# EAGLE design source_eagle (EAGLE 9.6.2)
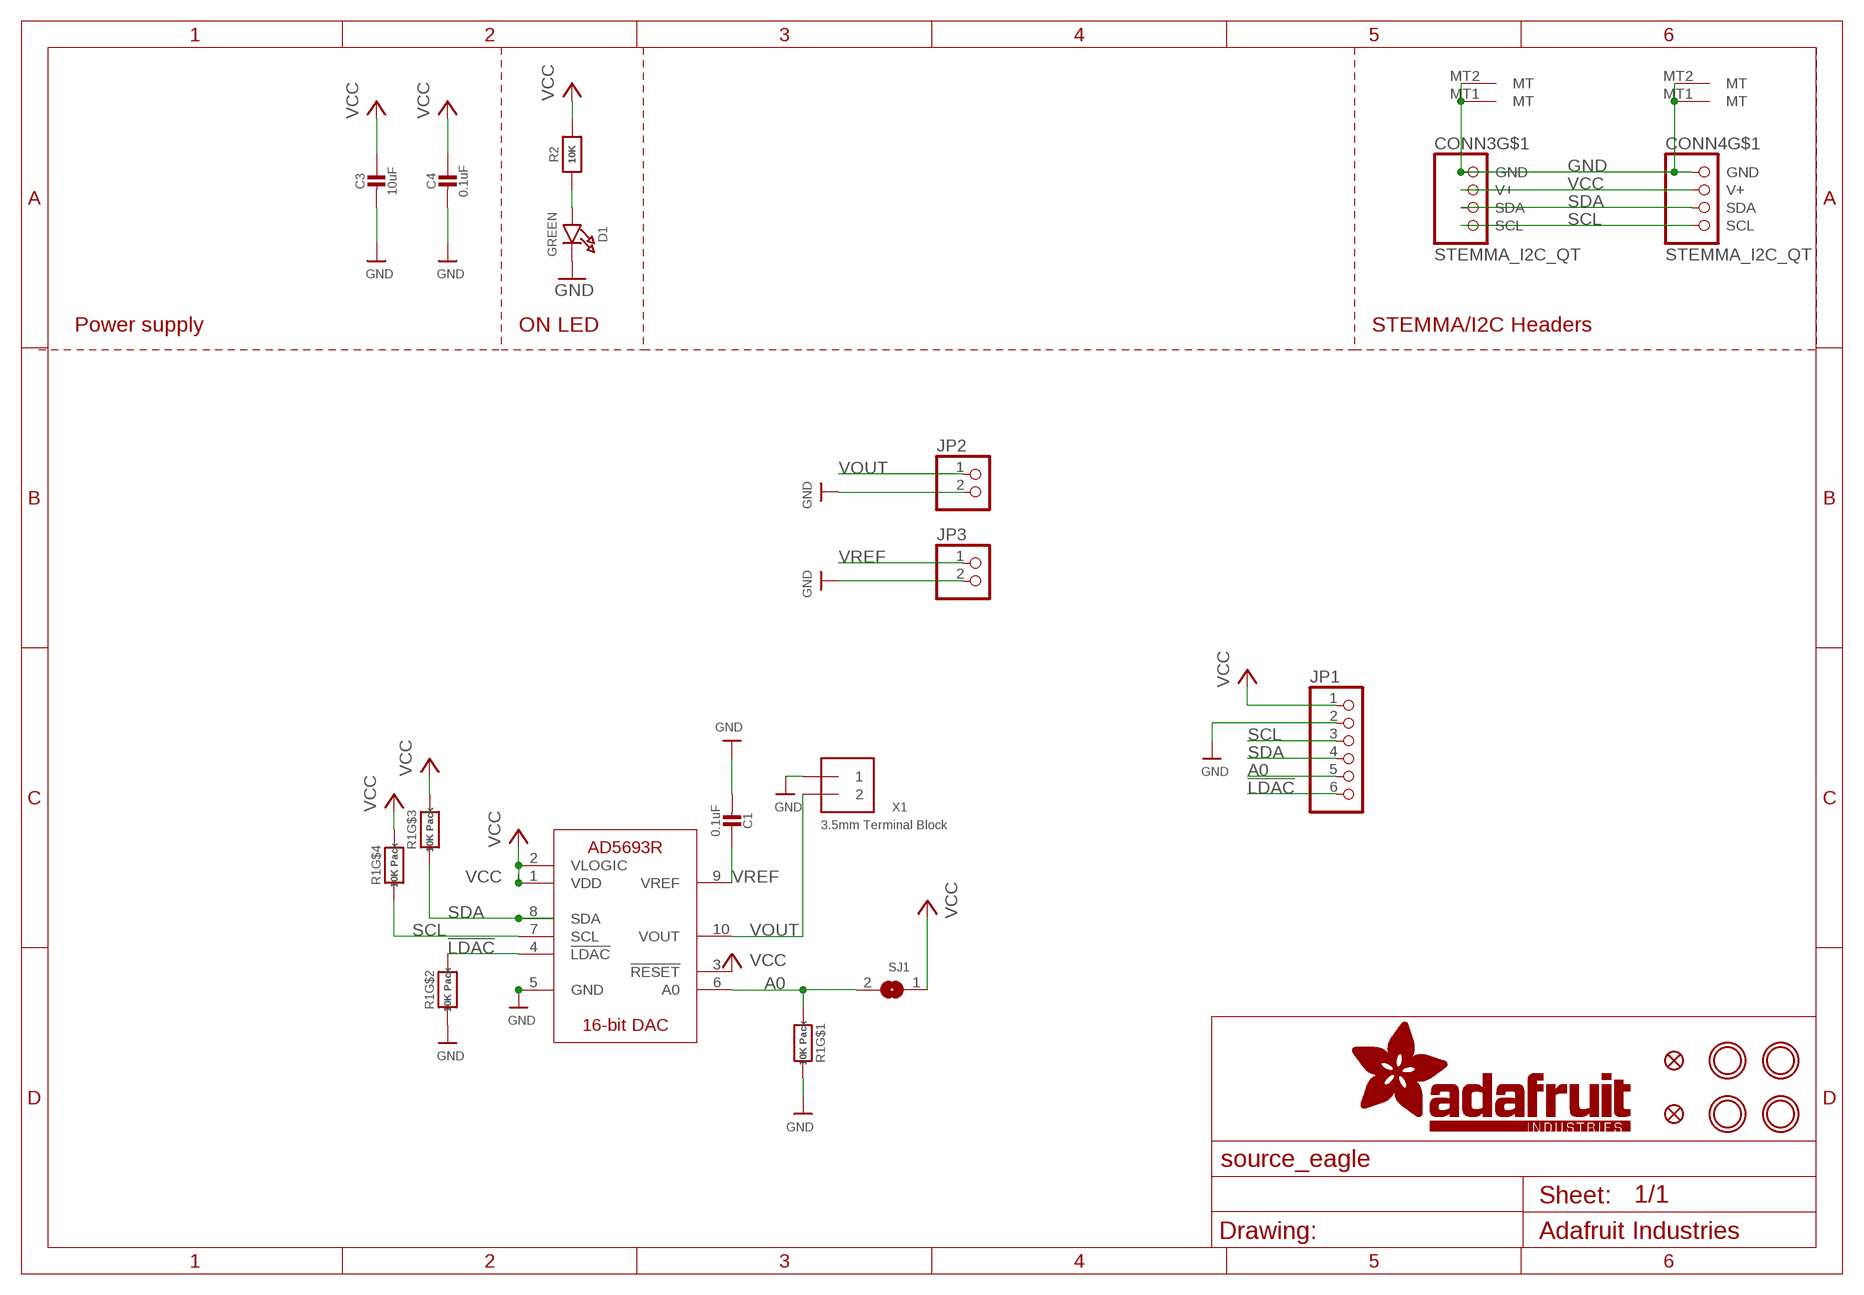
[diagram p0: schematic, sheet 1]

## Parts
C1  0.1uF  CAP_CERAMIC0603_NO  [0603-NO]
C3  10uF  CAP_CERAMIC0805-NOOUTLINE  [0805-NO]
C4  0.1uF  CAP_CERAMIC0603_NO  [0603-NO]
CONN3  STEMMA_I2C_QT  [JST_SH4]
CONN4  STEMMA_I2C_QT  [JST_SH4]
D1  GREEN  LED0603_NOOUTLINE  [CHIPLED_0603_NOOUTLINE]
FID3  FIDUCIAL_1MM  [FIDUCIAL_1MM]
FID4  FIDUCIAL_1MM  [FIDUCIAL_1MM]
IC2  AD5693R_10PIN_RMZ  [MSOP10]
JP1  HEADER-1X670MIL  [1X06_ROUND_70]
JP2  HEADER-1X2ROUND  [1X02_ROUND]
JP3  HEADER-1X2ROUND  [1X02_ROUND]
R1  10K Pack  RESISTOR_4PACK  [RESPACK_4X0603]
R2  10K  RESISTOR_0603_NOOUT  [0603-NO]
SJ1  SOLDERJUMPER  [SOLDERJUMPER_ARROW_NOPASTE]
U$20  MOUNTINGHOLE2.5  [MOUNTINGHOLE_2.5_PLATED]
U$21  MOUNTINGHOLE2.5  [MOUNTINGHOLE_2.5_PLATED]
U$25  MOUNTINGHOLE2.5  [MOUNTINGHOLE_2.5_PLATED]
U$27  MOUNTINGHOLE2.5  [MOUNTINGHOLE_2.5_PLATED]
X1  3.5mm Terminal Block  TERMBLOCK_1X2_3.5MM  [TERMBLOCK_1X2-3.5MM]

## Nets
!LDAC: IC2.4(!LDAC) JP1.6 R1.7
A0: IC2.6(A0) JP1.5 R1.8 SJ1.2
GND: C1.2 C3.2 C4.2 CONN3.1(GND) CONN3.MT1(MT) CONN3.MT2(MT) CONN4.1(GND) CONN4.MT1(MT) CONN4.MT2(MT) D1.C IC2.5(GND) JP1.2 JP2.2 JP3.2 R1.1 R1.2 X1.1
N$1: D1.A R2.1
SCL: CONN3.4(SCL) CONN4.4(SCL) IC2.7(SCL) JP1.3 R1.4
SDA: CONN3.3(SDA) CONN4.3(SDA) IC2.8(SDA) JP1.4 R1.3
VCC [highpower]: C3.1 C4.1 CONN3.2(V+) CONN4.2(V+) IC2.1(VDD) IC2.2(VLOGIC) IC2.3(!RESET) JP1.1 R1.5 R1.6 R2.2 SJ1.1
VOUT: IC2.10(VOUT) JP2.1 X1.2
VREF: C1.1 IC2.9(VREF) JP3.1

## Notes on the sheet
- Power supply | ON LED | STEMMA/I2C Headers

## Library data of the parts
C1 C3 C4 = microbuilder:CAP_CERAMIC: Ceramic Capacitors For new designs, use the packages preceded by an '_' character since they are more reliable: The following footprints should be used on most boards: _0402 - Standard footprint for regular board layouts _0603 - Standard footprint for regular board layouts _0805 - Standard footprint for regular board layouts _1206 - Standard footprint for regular board layouts For extremely tight-pitch boards where space is at a premium, the following 'micro-pitch' footprints can be used (smaller pads, no silkscreen outline, etc.): _0402MP - Micro-pitch footprint for very dense/compact boards _0603MP - Micro-pitch footprint for very dense/compact boards _0805MP - Micro-pitch footprint for very dense/compact boards _1206MP - Micro-pitch footprint for very dense/compact boards
CONN3 CONN4 = adafruit_electromech:STEMMA_I2C; LCSC: C2845363
D1 = microbuilder:LED: LED 0603 - 0603 Surface Mount Package 2mA: Green LED - Low Power (3.9mcd, 2ma, 1.7Vf) - Digikey: 475-2709-2-ND Orange LED - Low Power (9.8mcd, 2ma, 1.8Vf) - Digikey: 475-1194-2-ND Red LED - Low Power (5mcd, 2ma, 1.8Vf) - Digikey: 475-1195-2-ND Yellow LED - Low Power (7mcd, 2ma, 1.8Vf) - Digikey: 475-1196-2-ND 5mA: Blue LED - Low Power (17mcd, 5ma, 2.9Vf) - Digikey: LNJ937W8CRACT-ND 0805 - 0805 Surface Mount Package 2mA: Red LED (8.8mcd, 2mA, 1.8Vf, Clear) - Low Power [Digikey: 475-2510-1-ND] Green LED (5mcd, 2mA, 1.8Vf, Clear) - Low Power [Digikey: 475-2730-1-ND] Yellow LED (11.3mcd, 2mA, 1.8Vf, Clear) - Low Power [Digikey: 475-2555-1-ND] 20mA: Red LED (104mcd, 20mA, Diffused) - LS R976 [Digikey: 475-1278-6-ND] Red LED (12mcd, 20mA, 2.0Vf, Clear) - APT2012EC [Digikey: 754-1128-1-ND] Green LED (15mcd, 20mA, 2.2Vf, Clear) - APT2012GC [Digikey: 754-1131-1-ND] Orange LED (160mcd, 20mA, 2.1Vf, Clear) - APT2012SECK [Digikey: 754-1130-1-ND] 1206 - 1206 Surface Mount Package Green LED (26mcd, 20mA, Diffused) - LG N971 [Digikey: 475-1407-6-ND] Red LED (15mcd, 20mA, Diffused) - LH N974 [Digikey: 475-1416-6-ND] Cree - Cree High-Power Surface Mount LEDs XPEBWT-L1-0000-00D50 - White 111lm 350mA 2.9Vf 6200K 110° XTEAWT-00-0000-00000LEE3 - White 114lm 350mA 2.85Vf 5000K 115° Everlight - Everlight 45-21 Series Surface Mount LEDs 45-21/QK2C-B2832AC2CB2/2T - Warm White 2000mcd 20mA 3.25Vf 3050K 120° 45-21/LK2C-B38452C4CB2/2T - Nuetral White 2000mcd 20mA 3.25Vf 4150K 120° 45-21/LK2C-B50634C6CB2/2T - Cold White 2200mcd 20mA 3.25Vf 5650K 120° PLCC2 Reverse Mount LS T77K-J1L2-1-0-2-R18-Z - Red 11.25mcd 2mA 1.8Vf 630nm 120° LO T77K-L1M2-24-Z - Orange 19.6mcd 2mA 1.8Vf 606nm 120° LY T77K-K2M1-26-Z - Yellow 15.7mcd 2mA 1.8Vf 587nm 120°; ROT: 270
FID3 FID4 = microbuilder:FIDUCIAL: Fiducial Alignment Points Various fiducial points for machine vision alignment.; BOM: EXCLUDE
IC2 = adafruit_sensor:AD5693R_10PIN
JP1 = microbuilder:HEADER-1X6: PIN HEADER
JP2 JP3 = microbuilder:HEADER-1X2: PIN HEADER
R1 = microbuilder:RESISTOR_4PACK: Resistor Packs (4 resistors) 4 x 0603 10K 1/16W - Digikey: YC164J-10KCT-ND
R2 = microbuilder:RESISTOR: Resistors For new designs, use the packages preceded by an '_' character since they are more reliable: The following footprints should be used on most boards: _0402 - Standard footprint for regular board layouts _0603 - Standard footprint for regular board layouts _0805 - Standard footprint for regular board layouts _1206 - Standard footprint for regular board layouts For extremely tight-pitch boards where space is at a premium, the following 'micro-pitch' footprints can be used (smaller pads, no silkscreen outline, etc.): _0402MP - Micro-pitch footprint for very dense/compact boards _0603MP - Micro-pitch footprint for very dense/compact boards _0805MP - Micro-pitch footprint for very dense/compact boards _1206MP - Micro-pitch footprint for very dense/compact boards
SJ1 = microbuilder:SOLDERJUMPER: SMD Solder JUMPER Solder the two pads together to create a connection, or remove the solder to break it. REFLOW - Use this footprint for solder paste and reflow ovens. WAVE - Use this footprint for hand-soldering (larger pads). CLOSED - Has a trace between the two pads to ensure it is closed by default. The trace needs to be cut to disable the jumper, and can be closed again by creating a solder bridge between the two pads.; BOM: EXCLUDE
U$20 U$21 U$25 U$27 = adafruit_electromech:MOUNTINGHOLE: Mounting Hole For #2 screws (0.086"/2.18mm width, 0.094"/2.4mm hole) use 2.5mm; BOM: EXCLUDE
X1 = adafruit_electromech:TERMBLOCK_1X2: 3.5mm Terminal block http://www.ladyada.net/library/pcb/eaglelibrary.html; ROT: 180

## Net classes
1 highpower: width 0.305 mm, drill 0.483 mm
2 lowpower: width 0.254 mm, drill 0.483 mm

## Board
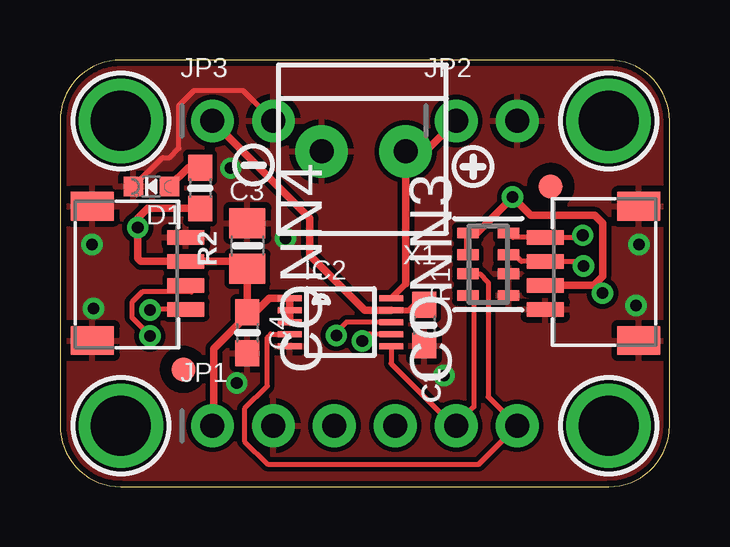
[diagram p1: board, top side]
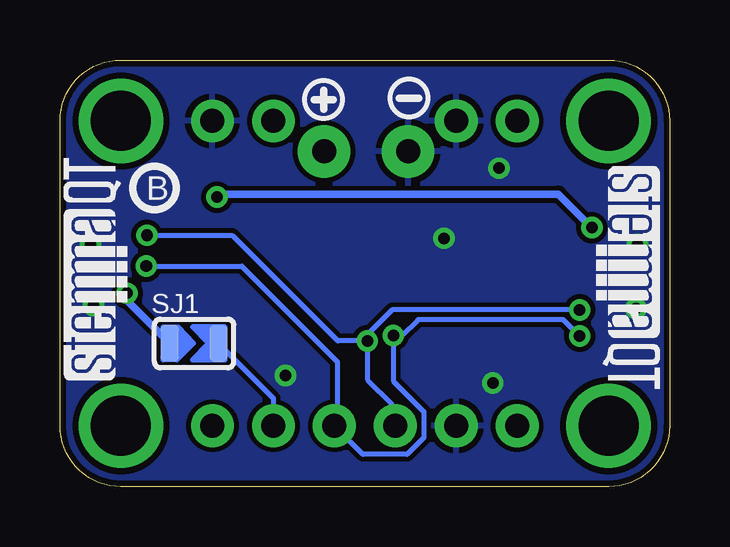
[diagram p2: board, bottom side, seen from below]

Size 25.4 x 17.78 mm. Coordinates in mm from the lower left corner, seen from the top.
Outline: 0,15.24 0,2.54 arc90 2.54,0 22.86,0 arc90 25.4,2.54 25.4,15.24 arc90 22.86,17.78 2.54,17.78 arc90 0,15.24
Copper layers (1*16): Top 0.035mm / dielectric 1.5mm / Bottom 0.035mm
Design rules "adafruit 8-8": minimum track width 6mil, minimum drill 15.5mil, track to track 8mil, track to pad 8mil, pad to pad 8mil, via to via 8mil, smd to smd 8mil, copper to edge 10mil, drill to drill 8mil, minimum pad ring 10mil, minimum via ring 8mil, stop-mask expansion 2mil, vias tented up to drill 20mil, thermal gap 10mil

### Footprints (pad centres in the part's own frame; a part is rotated, then mirrored left to right if it is on the bottom)
0603-NO = smd 1.075 x 1: 1 -0.85,0; 2 0.85,0
0805-NO = smd 1.24 x 1.5: 1 -0.95,0; 2 0.95,0
JST_SH4 = smd 0.6 x 1.55: 1 -1.5,2.006; 2 -0.5,2.006; 3 0.5,2.006; 4 1.5,2.006 | smd 1.2 x 1.8: MT1 -2.8,-1.894; MT2 2.8,-1.894
CHIPLED_0603_NOOUTLINE = smd 0.8 x 0.8: A 0,-0.75; C 0,0.75
FIDUCIAL_1MM = smd 1 x 1: 1 0,0
MSOP10 = smd 0.25 x 1: 1 -1,-2.113; 2 -0.5,-2.113; 3 0,-2.113; 4 0.5,-2.113; 5 1,-2.113; 6 1,2.113; 7 0.5,2.113; 8 0,2.113; 9 -0.5,2.113; 10 -1,2.113
1X06_ROUND_70 = drill 1 pad 1.778: 1 -6.35,0; 2 -3.81,0; 3 -1.27,0; 4 1.27,0; 5 3.81,0; 6 6.35,0
1X02_ROUND = drill 1 pad 1.778: 1 -1.27,0; 2 1.27,0
RESPACK_4X0603 = smd 0.45 x 0.9: 1 -1.3,-0.85; 2 -0.4,-0.85; 3 0.4,-0.85; 4 1.3,-0.85; 5 1.3,0.85; 6 0.4,0.85; 7 -0.4,0.85; 8 -1.3,0.85
SOLDERJUMPER_ARROW_NOPASTE = smd 0.762 x 1.524: 1 -1.016,0; 2 1.016,0
MOUNTINGHOLE_2.5_PLATED = drill 2.5 pad 3.2: P$1 0,0
TERMBLOCK_1X2-3.5MM = drill 1 pad 2.184: 1 1.8,0; 2 -1.7,0

### Placement (x,y rotation side)
C1  15.18,6.73 270 top
C3  7.81,10.03 90 top
C4  7.81,6.41 270 top
CONN3  22.23,8.89 90 top
CONN4  3.24,8.89 270 top
D1  3.81,12.51 90 top
FID3  5.14,4.89 0 top
FID4  20.45,12.51 0 top
IC2  11.68,6.86 270 top
JP1  12.7,2.54 0 top
JP2  17.78,15.24 0 top
JP3  7.62,15.24 0 top
PLABEL0  [PLABEL0]  6.35,0.89 0 top
PLABEL1  [PLABEL1]  8.89,4.19 0 top
PLABEL2  [PLABEL2]  11.43,0.89 0 top
PLABEL3  [PLABEL3]  13.97,4.19 0 top
PLABEL4  [PLABEL4]  19.18,4.19 0 top
PLABEL5  [PLABEL5]  16.64,0.89 0 top
PLABEL6  [PLABEL6]  12.51,9.33 0 top
PLABEL7  [PLABEL7]  0.25,12.38 0 top
PLABEL8  [PLABEL8]  12.7,16.32 0 top
PLABEL9  [PLABEL9]  6.35,16.89 0 top
PLABEL10  [PLABEL10]  19.18,16.89 0 top
PLABEL11  [PLABEL11]  12.7,11.81 0 bottom
PLABEL12  [PLABEL12]  13.08,8.95 0 bottom
PLABEL13  [PLABEL13]  12.64,0.95 0 bottom
PLABEL14  [PLABEL14]  19.81,4.25 0 bottom
PLABEL15  [PLABEL15]  10.67,5.4 0 bottom
R1  17.84,9.27 90 top
R2  5.84,12.45 270 top
SJ1  19.81,5.97 0 bottom
U$2  [SYMBOL_PLUS]  17.21,13.34 0 top
U$4  [SYMBOL_MINUS]  8.06,13.4 0 top
U$5  [SYMBOL_MINUS]  10.86,16.19 0 bottom
U$7  [SYMBOL_PLUS]  14.41,16.13 0 bottom
U$8  [PCBFEAT-REV-040]  21.46,12.45 0 bottom
U$20  2.54,15.24 0 top
U$21  22.86,15.24 0 top
U$25  2.54,2.54 0 top
U$27  22.86,2.54 0 top
U$31  [STEMMAQT]  22.61,4.45 90 bottom
U$32  [STEMMAQT]  3.05,13.34 270 bottom
X1  12.7,13.97 180 top

### Tracks (layer width: path | path; a pad name or v marks a point on that pad's centre or on a via)
!LDAC
  Top 0.203: R1.7 17.5,8.87 17.84,8.53 17.84,3.75 JP1.6 17.45,0.94 8.65,0.94 7.68,1.91 7.68,3.24 8.64,4.19 8.64,6.22 8.77,6.36 IC2.4
A0
  Top 0.203: R1.8 17.25,7.72 17.25,3.33 16.48,2.56 JP1.5 16.38,2.54 13.8,5.13 IC2.6
  Bottom 0.203: SJ1.2 16.51,3.68 JP1.5
GND  (via drill 0.48)
  Top 0.203: D1.C 4.27,13.72 4.57,13.72 4.95,14.1 4.95,15.88 5.59,16.51 7.62,16.51 JP3.2
  other vias: 7.37,4.32 1.33,10.1 1.4,7.43 24.13,10.1 24,7.56 9.4,10.35 7.11,13.27 16,4.64
  pour Top: 0,17.78 25.4,17.78 25.4,0 0,0
  pour Bottom: 0,17.78 25.4,17.78 25.4,0 0,0
N$1
  Top 0.305: D1.A 5.35,13.3 R2.1
SCL  (via drill 0.48)
  Top 0.203: R1.4 18.88,10.39 CONN3.4 21.69,10.39 v21.78,10.48 | CONN4.4 3.77,7.39 v3.75,7.37 | IC2.7 12.88,6.36 v12.6,6.07
  Bottom 0.203: v21.78,10.48 18.22,10.48 13.82,6.07 v12.6,6.07 | v3.75,7.37 11.56,7.37 12.76,6.16 12.68,6.07 v12.6,6.07 | v12.6,6.07 12.6,4.47 11.56,3.43 11.56,2.67 JP1.3
SDA  (via drill 0.48)
  Top 0.203: R1.3 18.95,9.67 19.23,9.39 CONN3.3 21.61,9.39 v21.81,9.19 | v3.75,6.27 3.75,6.31 3,7.06 3,7.68 3.44,8.12 5.48,8.12 CONN4.3 | IC2.8 11.94,6.86 11.45,6.37 v11.51,6.31
  Bottom 0.203: v21.81,9.19 17.83,9.19 13.84,5.21 13.84,2.67 JP1.4 12.78,1.35 10.94,1.35 10.24,2.05 10.24,3.12 11.51,4.4 v11.51,6.31 11.13,6.31 10.48,6.96 4.43,6.96 v3.75,6.27
VCC  (via drill 0.48)
  Top 0.305: C4.1 C3.1 7.5,9.39 CONN4.2 3.37,9.39 3.24,9.53 v3.24,10.79 3.24,11.18 3.66,11.6 R2.2 | C4.1 8.13,7.26 8.72,7.86 IC2.1 IC2.2 IC2.3 | R1.6 R1.5 17.37,10.57 v18.86,12.06 19.62,11.3 22.29,11.3 22.61,10.99 22.61,8.76 22.23,8.39 | 22.23,8.39 CONN3.2 | C4.1 7.81,7.15 6.41,5.75 6.41,2.6 JP1.1 | 22.23,8.39 22.28,8.39 v22.61,8.06
  Bottom 0.305: SJ1.1 22.61,7.75 v22.61,8.06 | v18.86,12.06 18.73,12.19 4.64,12.19 v3.24,10.79
VOUT
  Top 0.254: 14.4,8.46 IC2.10
  Top 0.305: JP2.1 15.24,13.97 X1.2 14.4,8.46
VREF
  Top 0.254: IC2.9 14.56,7.36 14.78,7.58 C1.1
  Top 0.305: IC2.9 12.71,7.36 10.41,9.65 10.41,11.18 JP3.1

### Text on the board
Pinguin_tBackup: VREF | GND | optional / terminal | on | AD5693 | GND | SDA | LDAC | VIN | SCL | A0
Pinguin_bBackup: AD5693R | 16-bit I2C DAC / w/Internal 2.5V Ref | Default I2C Addr 0x4C | 0x4E | VLogic/Vcc: 3-5VDC